# EAGLE design minimal_terminalv2_rc2014 (EAGLE 7.6.0)
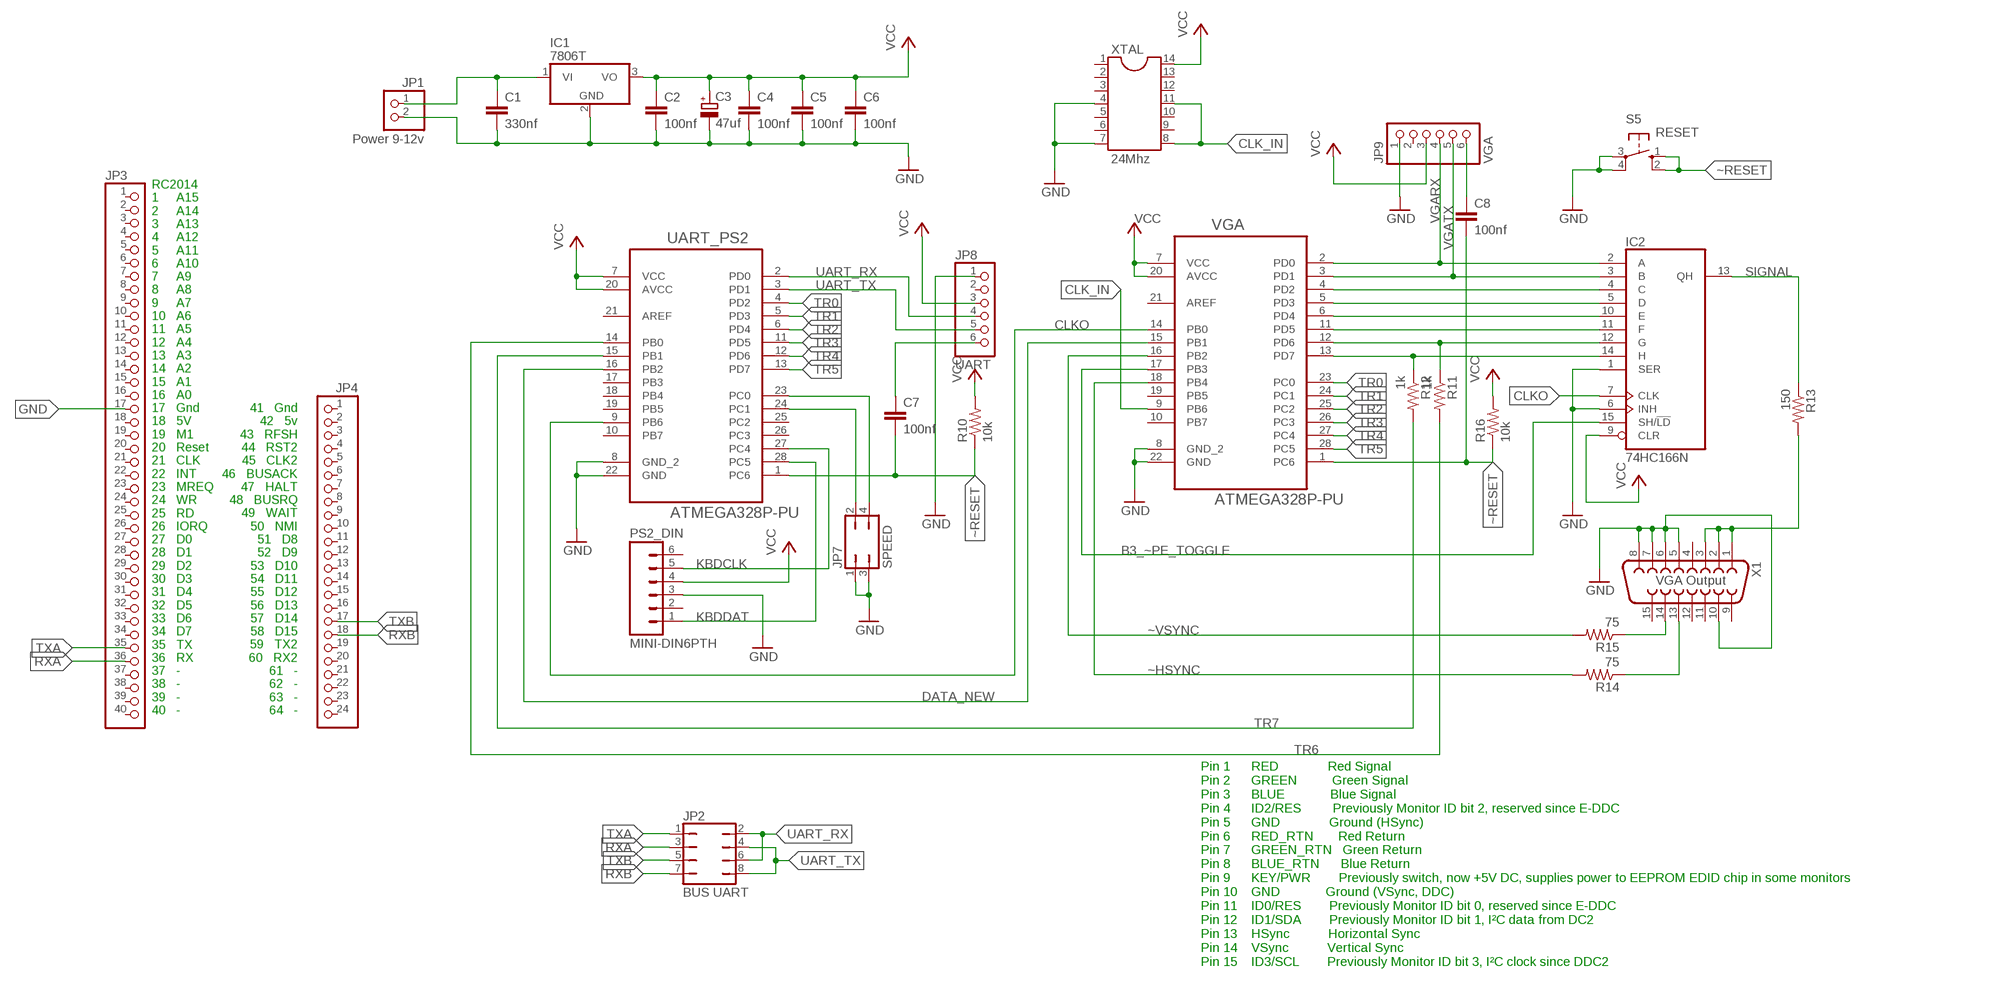
[diagram p0: schematic, sheet 1]

## Parts
C1  330nf  C2,5-3  [C2.5-3]
C2  100nf  C2,5-3  [C2.5-3]
C3  47uf  CPOL-EUE2.5-6  [E2,5-6]
C4  100nf  C2,5-3  [C2.5-3]
C5  100nf  C2,5-3  [C2.5-3]
C6  100nf  C2,5-3  [C2.5-3]
C7  100nf  C2,5-3  [C2.5-3]
C8  100nf  C2,5-3  [C2.5-3]
IC1  7806T  [TO220H]
IC2  74HC166N  [DIL16]
JP1  Power 9-12v  PINHD-1X2  [1X02]
JP2  BUS UART  JP4Q  [JP4Q]
JP3  PINHD-1X40  [1X40]
JP4  PINHD-1X24  [1X24]
JP7  SPEED  JP2Q  [JP2Q]
JP8  UART  PINHD-1X6  [1X06]
JP9  VGA  PINHD-1X6  [1X06]
PS2_DIN  MINI-DIN6PTH  [MINI-DIN6]
R10  10k  R-US_0204/7  [0204/7]
R11  1k  R-US_0204/7  [0204/7]
R12  1k  R-US_0204/7  [0204/7]
R13  150  R-US_0204/7  [0204/7]
R14  75  R-US_0204/7  [0204/7]
R15  75  R-US_0204/7  [0204/7]
R16  10k  R-US_0204/7  [0204/7]
S5  RESET  10-XX  [B3F-10XX]
UART_PS2  ATMEGA328P-PU  [DIP254P762X457-28]
VGA  ATMEGA328P-PU  [DIP254P762X457-28]
X1  VGA Output  F15HDH  [HDF15H]
XTAL  24Mhz  DIL14S  [SOCKET-14]

## Nets
B3_~PE_TOGGLE: IC2.15(SH/!LD) VGA.17(PB3)
CLK_IN: VGA.9(PB6) XTAL.8 XTAL.11
CLKO: IC2.7(CLK) UART_PS2.9(PB6) VGA.14(PB0)
DATA_NEW: UART_PS2.16(PB2) VGA.15(PB1)
GND [VCC]: C1.2 C2.2 C3.- C4.2 C5.2 C6.2 IC1.2(GND) IC2.1(SER) IC2.6(INH) JP1.2 JP3.17 JP7.1 JP7.3 JP8.1 JP9.1 PS2_DIN.3 S5.3(P) S5.4(P1) UART_PS2.8(GND_2) UART_PS2.22(GND) VGA.8(GND_2) VGA.22(GND) X1.5 X1.6 X1.7 X1.8 X1.10 XTAL.4 XTAL.7
KBDCLK: PS2_DIN.5 UART_PS2.27(PC4)
KBDDAT: PS2_DIN.1 UART_PS2.28(PC5)
N$9: C1.1 IC1.1(VI) JP1.1
N$14: C7.1 JP8.6
N$15: JP7.2 UART_PS2.24(PC1)
N$16: JP7.4 UART_PS2.23(PC0)
N$17: IC2.12(G) R11.1 VGA.12(PD6)
N$18: IC2.14(H) R12.1 VGA.13(PD7)
N$21: IC2.4(C) VGA.4(PD2)
N$22: IC2.5(D) VGA.5(PD3)
N$23: IC2.10(E) VGA.6(PD4)
N$24: IC2.11(F) VGA.11(PD5)
N$26: R13.2 X1.1 X1.2 X1.3
N$27: R14.1 X1.13
N$28: R15.1 X1.14
N$31: C8.1 JP9.6
RXA: JP2.3 JP3.36
RXB: JP2.7 JP4.18
SIGNAL: IC2.13(QH) R13.1
TR0: UART_PS2.4(PD2) VGA.23(PC0)
TR1: UART_PS2.5(PD3) VGA.24(PC1)
TR2: UART_PS2.6(PD4) VGA.25(PC2)
TR3: UART_PS2.11(PD5) VGA.26(PC3)
TR4: UART_PS2.12(PD6) VGA.27(PC4)
TR5: UART_PS2.13(PD7) VGA.28(PC5)
TR6: R11.2 UART_PS2.14(PB0)
TR7: R12.2 UART_PS2.15(PB1)
TXA: JP2.1 JP3.35
TXB: JP2.5 JP4.17
UART_RX: JP2.2 JP2.6 JP8.4 UART_PS2.2(PD0)
UART_TX: JP2.4 JP2.8 JP8.5 UART_PS2.3(PD1)
VCC [VCC]: C2.1 C3.+ C4.1 C5.1 C6.1 IC1.3(VO) IC2.9(CLR) JP8.3 JP9.3 PS2_DIN.4 R10.2 R16.2 UART_PS2.7(VCC) UART_PS2.20(AVCC) VGA.7(VCC) VGA.20(AVCC) XTAL.14
VGARX: IC2.2(A) JP9.4 VGA.2(PD0)
VGATX: IC2.3(B) JP9.5 VGA.3(PD1)
~HSYNC: R14.2 VGA.18(PB4)
~RESET: C7.2 C8.2 R10.1 R16.1 S5.1(S) S5.2(S1) UART_PS2.1(PC6) VGA.1(PC6)
~VSYNC: R15.2 VGA.16(PB2)
Unconnected: JP3.1 JP3.2 JP3.3 JP3.4 JP3.5 JP3.6 JP3.7 JP3.8 JP3.9 JP3.10 JP3.11 JP3.12 JP3.13 JP3.14 JP3.15 JP3.16 JP3.18 JP3.19 JP3.20 JP3.21 JP3.22 JP3.23 JP3.24 JP3.25 JP3.26 JP3.27 JP3.28 JP3.29 JP3.30 JP3.31 JP3.32 JP3.33 JP3.34 JP3.37 JP3.38 JP3.39 JP3.40 JP4.1 JP4.2 JP4.3 JP4.4 JP4.5 JP4.6 JP4.7 JP4.8 JP4.9 JP4.10 JP4.11 JP4.12 JP4.13 JP4.14 JP4.15 JP4.16 JP4.19 JP4.20 JP4.21 JP4.22 JP4.23 JP4.24 JP8.2 JP9.2 PS2_DIN.2 PS2_DIN.6 UART_PS2.10(PB7) UART_PS2.17(PB3) UART_PS2.18(PB4) UART_PS2.19(PB5) UART_PS2.21(AREF) UART_PS2.25(PC2) UART_PS2.26(PC3) VGA.10(PB7) VGA.19(PB5) VGA.21(AREF) X1.4 X1.9 X1.11 X1.12 X1.15 XTAL.1 XTAL.2 XTAL.3 XTAL.5 XTAL.6 XTAL.9 XTAL.10 XTAL.12 XTAL.13

## Notes on the sheet
- RC2014
  1     A15
  2     A14
  3     A13
  4     A12
  5     A11
  6     A10
  7     A9
  8     A8
  9     A7
  10   A6
  11   A5
  12   A4
  13   A3
  14   A2
  15   A1
  16   A0
  17   Gnd
  18   5V
  19   M1
  20   Reset
  21   CLK
  22   INT
  23   MREQ
  24   WR
  25   RD
  26   IORQ
  27   D0
  28   D1
  29   D2
  30   D3
  31   D4
  32   D5
  33   D6
  34   D7
  35   TX
  36   RX
  37   -
  38   -
  39   -
  40   -
- 41   Gnd
  42   5v
  43   RFSH
  44   RST2
  45   CLK2
  46   BUSACK
  47   HALT
  48   BUSRQ
  49   WAIT
  50   NMI
  51   D8
  52   D9
  53   D10
  54   D11
  55   D12
  56   D13
  57   D14
  58   D15
  59   TX2
  60   RX2
  61   -
  62   -
  63   -
  64   -
- Pin 1      RED              Red Signal
  Pin 2      GREEN          Green Signal
  Pin 3      BLUE             Blue Signal
  Pin 4      ID2/RES         Previously Monitor ID bit 2, reserved since E-DDC
  Pin 5      GND              Ground (HSync)
  Pin 6      RED_RTN       Red Return
  Pin 7      GREEN_RTN   Green Return
  Pin 8      BLUE_RTN      Blue Return
  Pin 9      KEY/PWR        Previously switch, now +5V DC, supplies power to EEPROM EDID chip in some monitors
  Pin 10    GND             Ground (VSync, DDC)
  Pin 11    ID0/RES        Previously Monitor ID bit 0, reserved since E-DDC
  Pin 12    ID1/SDA        Previously Monitor ID bit 1, I²C data from DC2
  Pin 13    HSync           Horizontal Sync
  Pin 14    VSync           Vertical Sync
  Pin 15    ID3/SCL        Previously Monitor ID bit 3, I²C clock since DDC2

## Power pins joined to a net without a drawn wire
GND: IC2.8(GND)
VCC: IC2.16(VCC)

## Library data of the parts
C1 C2 C4-C8 = capacitor-wima:C: CAPACITOR naming: grid - package width
C3 = rcl:CPOL-EU: POLARIZED CAPACITOR, European symbol
IC1 = linear:78*: Positive VOLTAGE REGULATOR Source: http://cache.national.com/ds/LM/LM78L05.pdf http://www.fairchildsemi.com/ds/LM/LM7805.pdf
IC2 = 74xx-eu:74*166: 8-bit parallel load SHIFT REGISTER
JP1 = pinhead:PINHD-1X2: PIN HEADER
JP2 = jumper:JP4Q: JUMPER
JP3 = pinhead:PINHD-1X40: PIN HEADER
JP4 = pinhead:PINHD-1X24: PIN HEADER
JP7 = jumper:JP2Q: JUMPER
JP8 JP9 = adafruit:PINHD-1X6: PIN HEADER
PS2_DIN = SparkFun-Connectors:MINI-DIN6: mini DIN 6 Connector Commonly found on the back of a computer for PS2 keyboard and mice. Schematic and footprint are proven. Spark Fun Electronics SKU : PRT-08509
R10-R16 = adafruit:R-US_: RESISTOR, American symbol
S5 = switch-omron:10-XX: OMRON SWITCH; MPN: B3F-1000; OC_FARNELL: 176432; OC_NEWARK: 36M3542
UART_PS2 VGA = Atmel_By_element14_Batch_1-00:ATMEGA328P-PU: 8-bit Microcontroller with In-System Programmable Flash; MPN: ATMEGA328P-PU; OC_FARNELL: 1715487; OC_NEWARK: 15R0268; PACKAGE: PDIP-28; SUPPLIER: Atmel
X1 = adafruit:F15: SUB-D HDH is also known as a 'right angle VGA' connector
XTAL = ic-package:DIL14: Dual In Line / Socket

## Net classes
1 VCC: width 0.61 mm

## Board
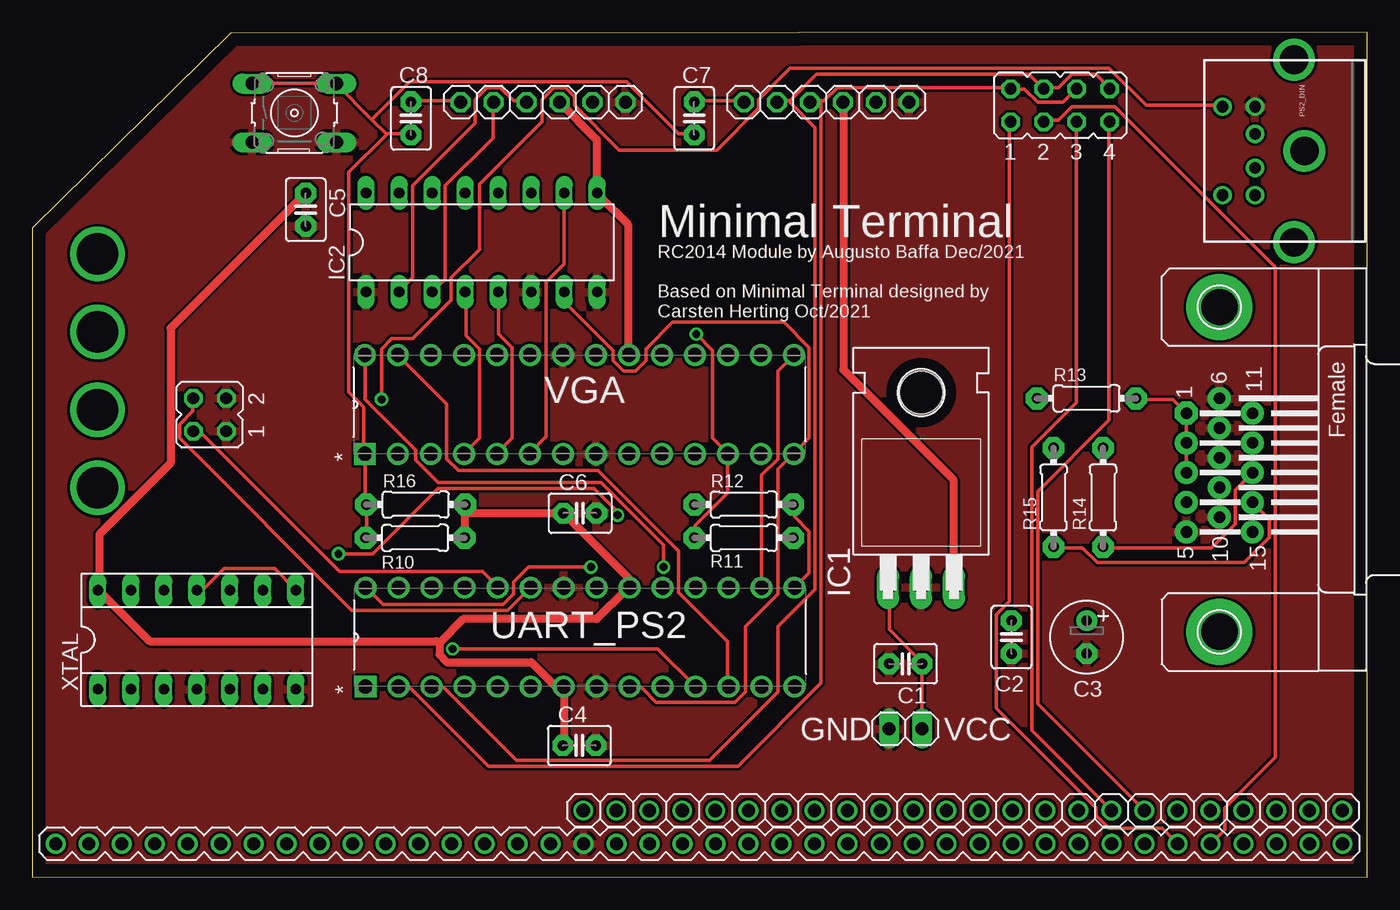
[diagram p1: board, top side]
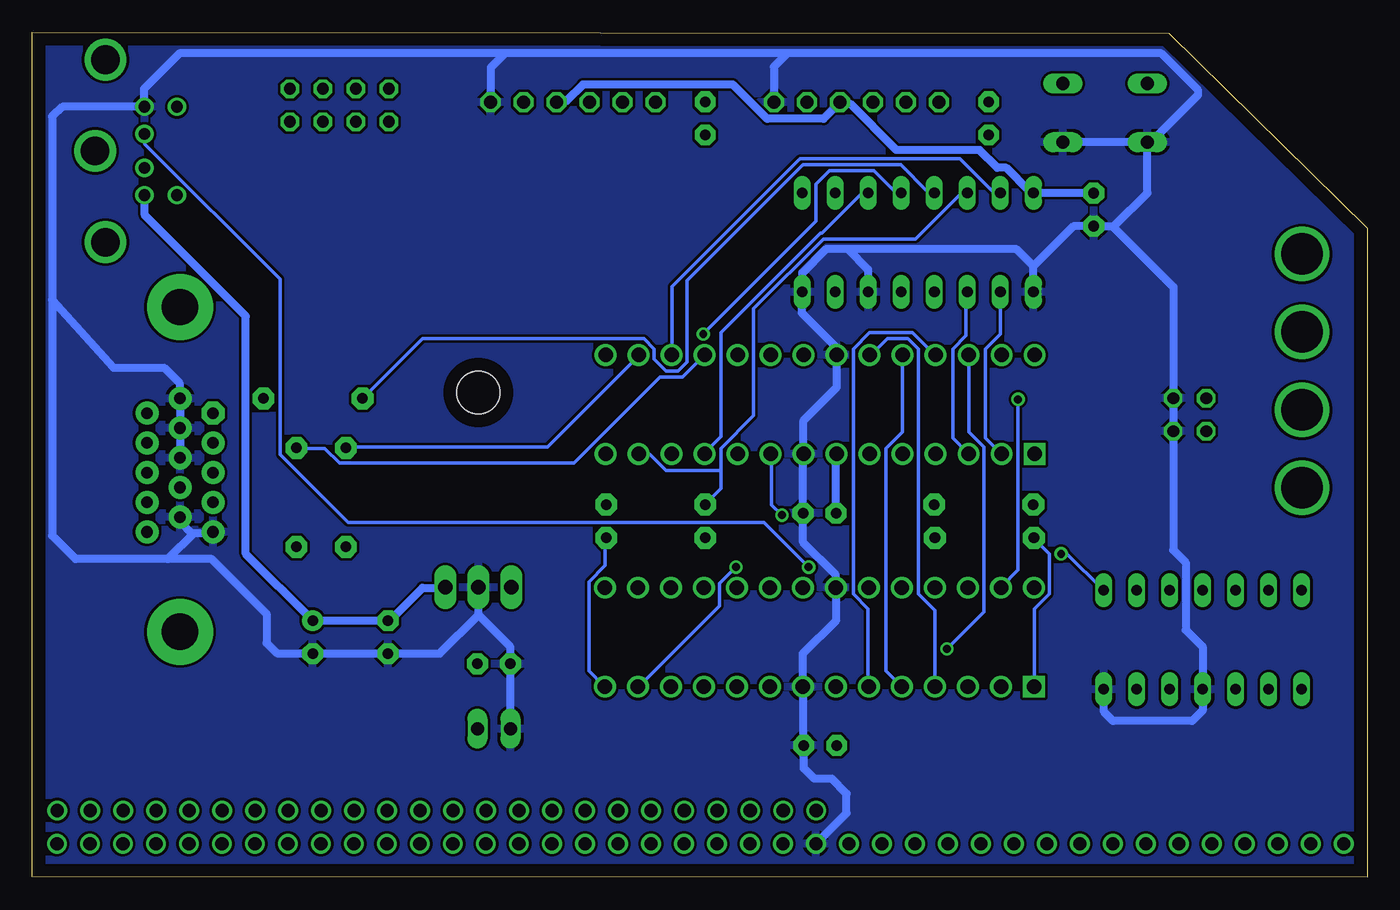
[diagram p2: board, bottom side, seen from below]

Size 102.72 x 65.05 mm. Coordinates in mm from the lower left corner, seen from the top.
Outline: 0,0 102.72,0.05 102.72,65.05 15.24,65 0,50 0,0
Copper layers (1*16): Top 0.035mm / dielectric 1.5mm / Bottom 0.035mm
Design rules "default": minimum track width 10mil, minimum drill 24mil, track to track 8mil, track to pad 8mil, pad to pad 8mil, via to via 8mil, smd to smd 8mil, copper to edge 40mil, drill to drill 8mil, minimum pad ring 10mil, minimum via ring 8mil, stop-mask expansion 4mil, vias tented up to drill 0mil, thermal gap 10mil

### Footprints (pad centres in the part's own frame; a part is rotated, then mirrored left to right if it is on the bottom)
C2.5-3 = drill 0.813 pad 1.6 octagon: 1 -1.27,0; 2 1.27,0
E2,5-6 = drill 0.813 pad 1.6: + -1.27,0 | drill 0.813 pad 1.6 octagon: - 1.27,0
TO220H = drill 1.118 long: 1 -2.54,-10.16; 2 0,-10.16; 3 2.54,-10.16 | hole 3.302: 0,4.826
DIL16 = drill 0.813 long: 1 -8.89,-3.81; 2 -6.35,-3.81; 3 -3.81,-3.81; 4 -1.27,-3.81; 5 1.27,-3.81; 6 3.81,-3.81; 7 6.35,-3.81; 8 8.89,-3.81; 9 8.89,3.81; 10 6.35,3.81; 11 3.81,3.81; 12 1.27,3.81; 13 -1.27,3.81; 14 -3.81,3.81; 15 -6.35,3.81; 16 -8.89,3.81
1X02 = drill 1.016 long: 1 -1.27,0; 2 1.27,0
JP4Q = drill 0.914 octagon: 1 -3.81,-1.27; 2 -3.81,1.27; 3 -1.27,-1.27; 4 -1.27,1.27; 5 1.27,-1.27; 6 1.27,1.27; 7 3.81,-1.27; 8 3.81,1.27
1X40 = drill 1.016: 1 -49.53,0; 2 -46.99,0; 3 -44.45,0; 4 -41.91,0; 5 -39.37,0; 6 -36.83,0; 7 -34.29,0; 8 -31.75,0; 9 -29.21,0; 10 -26.67,0; 11 -24.13,0; 12 -21.59,0; 13 -19.05,0; 14 -16.51,0; 15 -13.97,0; 16 -11.43,0; 17 -8.89,0; 18 -6.35,0; 19 -3.81,0; 20 -1.27,0; 21 1.27,0; 22 3.81,0; 23 6.35,0; 24 8.89,0; 25 11.43,0; 26 13.97,0; 27 16.51,0; 28 19.05,0; 29 21.59,0; 30 24.13,0; 31 26.67,0; 32 29.21,0; 33 31.75,0; 34 34.29,0; 35 36.83,0; 36 39.37,0; 37 41.91,0; 38 44.45,0; 39 46.99,0; 40 49.53,0
1X24 = drill 1.016: 1 -29.21,0; 2 -26.67,0; 3 -24.13,0; 4 -21.59,0; 5 -19.05,0; 6 -16.51,0; 7 -13.97,0; 8 -11.43,0; 9 -8.89,0; 10 -6.35,0; 11 -3.81,0; 12 -1.27,0; 13 1.27,0; 14 3.81,0; 15 6.35,0; 16 8.89,0; 17 11.43,0; 18 13.97,0; 19 16.51,0; 20 19.05,0; 21 21.59,0; 22 24.13,0; 23 26.67,0; 24 29.21,0
JP2Q = drill 0.914 octagon: 1 -1.27,-1.27; 2 -1.27,1.27; 3 1.27,-1.27; 4 1.27,1.27
1X06 = drill 1.016 octagon: 1 -6.35,0; 2 -3.81,0; 3 -1.27,0; 4 1.27,0; 5 3.81,0; 6 6.35,0
MINI-DIN6 = drill 0.9: 1 -1.3,-8.5; 2 1.3,-8.5; 3 -3.4,-8.5; 4 3.4,-8.5; 5 -3.4,-11; 6 3.4,-11 | drill 2.2: P$1 0,-4.7
0204/7 = drill 0.813 pad 1.676 octagon: 1 -3.81,0; 2 3.81,0
B3F-10XX = drill 1.016 long: 1 -3.251,2.261; 2 3.251,2.261; 3 -3.251,-2.261; 4 3.251,-2.261
DIP254P762X457-28 = drill 1.118 square: 1 -7.62,33.02 | drill 1.118: 2 -7.62,30.48; 3 -7.62,27.94; 4 -7.62,25.4; 5 -7.62,22.86; 6 -7.62,20.32; 7 -7.62,17.78; 8 -7.62,15.24; 9 -7.62,12.7; 10 -7.62,10.16; 11 -7.62,7.62; 12 -7.62,5.08; 13 -7.62,2.54; 14 -7.62,0; 15 0,0; 16 0,2.54; 17 0,5.08; 18 0,7.62; 19 0,10.16; 20 0,12.7; 21 0,15.24; 22 0,17.78; 23 0,20.32; 24 0,22.86; 25 0,25.4; 26 0,27.94; 27 0,30.48; 28 0,33.02
HDF15H = drill 0.9 pad 1.778 octagon: 1 4.329,2.54 | drill 0.9 pad 1.778: 2 2.043,2.54; 3 -0.243,2.54; 4 -2.529,2.54; 5 -4.815,2.54; 6 5.472,0; 7 3.186,0; 8 0.9,0; 9 -1.386,0; 10 -3.672,0; 11 4.329,-2.54; 12 2.043,-2.54; 13 -0.243,-2.54; 14 -2.529,-2.54; 15 -4.815,-2.54 | drill 2.8 pad 5.08: P$1 -12.5,0; P$2 12.5,0
SOCKET-14 = drill 0.813 long: 1 -7.62,-3.81; 2 -5.08,-3.81; 3 -2.54,-3.81; 4 0,-3.81; 5 2.54,-3.81; 6 5.08,-3.81; 7 7.62,-3.81; 8 7.62,3.81; 9 5.08,3.81; 10 2.54,3.81; 11 0,3.81; 12 -2.54,3.81; 13 -5.08,3.81; 14 -7.62,3.81

### Placement (x,y rotation side)
C1  67.2,16.45 180 top
C2  75.35,18.5 270 top
C3  81.15,18.5 270 top
C4  42.09,10.16 0 top
C5  21.03,51.41 270 top
C6  42.14,28.04 0 top
C7  50.93,58.44 270 top
C8  29.13,58.44 270 top
IC1  68.4,32.5 0 top
IC2  34.57,48.89 0 top
JP1  67.2,11.45 180 top
JP2  79.1,59.45 0 top
JP3  51.31,2.6 0 top
JP4  71.61,5.15 0 top
JP7  13.64,35.62 90 top
JP8  61.11,59.69 180 top
JP9  39.3,59.69 180 top
PS2_DIN  102.6,55.93 270 top
R10  29.45,26.14 0 top
R11  54.75,26.14 0 top
R12  54.75,28.71 0 top
R13  81.13,36.88 0 top
R14  82.4,29.26 90 top
R15  78.59,29.26 90 top
R16  29.5,28.71 0 top
S5  20.16,58.86 0 top
UART_PS2  58.66,22.31 90 top
VGA  58.61,40.22 90 top
X1  91.36,31.41 90 top
XTAL  12.65,18.3 0 top

### Tracks (layer width: path | path; a pad name or v marks a point on that pad's centre or on a via)
B3_~PE_TOGGLE
  Bottom 0.254: IC2.15 28.23,52.81 28.8,52.81 31.32,55.32 43.66,55.32 53.49,45.49 53.49,40.23 VGA.17
CLK_IN  (via drill 0.61)
  Top 0.254: XTAL.11 12.69,22.17 13.14,22.17 14.74,23.77 18.63,23.77 20.23,22.17 XTAL.8 | v45.03,27.89 45.03,28.12 43.2,29.95 31.2,29.95 26.18,24.92 v23.55,24.92
  Bottom 0.254: v45.03,27.89 45.83,28.69 45.83,32.58 VGA.9 | v23.55,24.92 23.09,24.92 20.34,22.17 XTAL.8
CLKO
  Top 0.254: IC2.7 41.03,45.03 41.03,44.23 44.69,40.58 44.69,39.78 45.49,38.98 46.41,38.98 47.21,39.78 47.21,40.69 49.26,42.75 57.84,42.75 59.78,40.8 59.78,33.83 58.64,32.69 VGA.14 58.52,32.58 57.38,31.43 57.38,21.83 54.86,19.32 54.86,14.29 54.06,13.49 48.01,13.49 46.86,14.63 46.06,14.63 UART_PS2.9
DATA_NEW
  Top 0.254: UART_PS2.16 56.12,22.4 56.12,30.98 57.38,32.23 57.38,38.98 58.52,40.12 VGA.15
GND
  Bottom 0.61: 40,48.4 41.6,48.4 43.46,46.54 IC2.8 43.5,45.04 43.5,43.45 40.83,40.78 VGA.22 40.8,40.19 40.8,37.75 43.37,35.18 VGA.8 43.41,32.56 C6.2 43.4,25.8 40.88,23.28 UART_PS2.22 40.85,22.28 40.85,19.8 43.42,17.23 UART_PS2.8 43.36,14.63 C4.2 43.35,8.4 42.55,7.6 41.2,7.6 40.05,6.45 40.05,4.95 42.4,2.6 JP3.17 | 40,48.4 38.4,46.8 38.4,45.1 IC2.6 | IC2.1 25.68,47.05 | 40,48.4 27.03,48.4 25.68,47.05 | 25.68,47.05 22.59,50.14 C5.2 19.59,50.14 19.4,49.95 | 19.4,49.95 14.9,45.45 JP7.3 JP7.1 14.91,25.21 13.95,24.25 13.95,19.05 12.65,17.75 XTAL.4 12.65,12.85 13.45,12.05 19.55,12.05 20.25,12.75 20.25,14.47 XTAL.7 | 19.4,49.95 19.4,50.2 16.9,52.7 S5.3 | S5.3 S5.4 | S5.3 16.65,56.6 13,60.25 13,60.6 15.85,63.45 44.6,63.45 | 44.6,63.45 45.65,62.4 JP9.1 | 44.6,63.45 66.35,63.45 | 66.35,63.45 67.45,62.35 JP8.1 | 66.35,63.45 91.4,63.45 94.15,60.7 94.15,59.38 PS2_DIN.3 100.42,59.33 101.2,58.6 101.2,44.45 | 101.2,44.45 96.5,39.25 92.6,39.25 91.4,38.05 91.4,36.92 X1.6 X1.7 X1.8 | X1.10 91.36,27.41 90.45,26.5 90.31,26.5 | X1.5 88.92,26.5 90.31,26.5 | 68.4,20.2 71.37,17.23 C2.2 C3.- 81.17,17.25 83.9,17.25 84.7,18.05 84.7,20.3 88.92,24.52 92.3,24.52 | 68.4,20.2 IC1.2 | JP1.2 C1.2 65.93,17.73 68.4,20.2 | 92.3,24.52 99.4,24.52 101.2,26.32 101.2,44.45 | 90.31,26.5 92.3,24.52
  pour Top: 0,0 0,50 15.24,65 102.72,65.05 102.72,0.05
  pour Bottom: 0,0 0,50 15.24,65 102.72,65.05 102.72,0.05
KBDCLK  (via drill 0.61)
  Top 0.254: v26.86,36.8 26.86,40.69 27.66,41.49 29.26,41.49 32.23,44.46 32.23,46.18 34.4,48.35 34.4,53.38 39.2,58.18 39.2,59.89 40.12,60.81 41.03,60.81 41.72,60.12 41.72,59.44 45.15,56.01 52.69,56.01 55.89,59.21 55.89,59.89 58.29,62.29 82.87,62.29 85.72,59.44 91.55,59.44 PS2_DIN.5
  Bottom 0.254: v26.86,36.8 26.86,23.66 28.12,22.4 UART_PS2.27
KBDDAT  (via drill 0.61)
  Top 0.254: v42.98,23.89 38.18,23.89 37.03,22.75 37.03,21.83 36.23,21.03 26.98,21.03 25.72,22.29 UART_PS2.28
  Bottom 0.254: v42.98,23.89 46.41,27.32 78.41,27.32 83.67,32.58 83.67,46.06 94.07,56.46 94.07,57.15 PS2_DIN.1
N$1  (via drill 3.2)
  other vias: 5,42
N$2  (via drill 3.2)
  other vias: 5,30
N$3  (via drill 2.2)
  other vias: 97.1,48.9
N$4  (via drill 2.2)
  other vias: 97.1,62.95
N$9
  Top 0.254: JP1.1 68.47,11.54 68.47,16.34 C1.1 68.47,16.57 65.95,19.09 65.95,22.29 IC1.1
N$14
  Top 0.254: JP8.6 54.75,59.78 50.98,59.78 C7.1
N$15
  Top 0.254: JP7.2 12.46,34.29 12.92,34.29 23.66,23.55 34.63,23.55 35.78,22.4 UART_PS2.24
N$16
  Top 0.254: JP7.4 12.34,36.8 12.34,35.89 11.32,34.86 11.32,33.83 24.57,20.57 36.58,20.57 38.29,22.29 UART_PS2.23
N$17  (via drill 0.61)
  Top 0.254: v51.09,41.83 52.35,40.58 52.35,33.83 53.49,32.69 VGA.12 53.49,32.58 53.49,29.6 50.98,27.09 50.98,26.18 R11.1
  Bottom 0.254: v51.09,41.83 42.41,50.52 42.41,53.38 41.38,54.41 37.95,54.41 36.35,52.81 35.89,52.81 IC2.12
N$18
  Bottom 0.254: 49.72,31.32 49.72,29.95 50.86,28.8 R12.1 | 49.72,31.32 49.72,33.03 47.21,35.55 47.21,43.78 41.83,49.15 34.75,49.15 31.2,52.69 30.86,52.69 IC2.14 | 49.72,31.32 53.95,31.32 55.21,32.58 56.01,32.58 VGA.13
N$20  (via drill 3.2)
  other vias: 5,48
N$21
  Top 0.254: IC2.4 33.38,45.03 33.38,41.72 34.4,40.69 34.4,33.83 33.26,32.69 VGA.4
N$22
  Top 0.254: IC2.5 35.89,45.03 35.89,41.83 36.92,40.8 36.92,33.83 35.78,32.69 VGA.5
N$23
  Top 0.254: IC2.10 40.92,47.21 39.55,45.83 39.55,33.95 38.29,32.69 VGA.6
N$24
  Bottom 0.254: IC2.11 38.41,52.69 38.86,52.69 41.95,49.61 42.06,49.61 49.72,41.95 49.72,33.95 50.98,32.69 VGA.11
N$25  (via drill 3.2)
  other vias: 5,36
N$26
  Top 0.254: X1.3 88.81,31.2 88.81,33.38 X1.2 88.81,33.49 88.81,35.66 X1.1 88.81,35.78 87.78,36.8 85.04,36.8 R13.2
N$27
  Top 0.254: R14.1 82.41,25.38 90.75,25.38 92.58,27.2 92.58,29.83 93.84,31.09 X1.13
N$28
  Top 0.254: R15.1 78.64,25.38 80.81,25.38 81.95,24.23 93.27,24.23 95.21,26.18 95.21,27.55 93.95,28.8 X1.14
N$31
  Top 0.254: JP9.6 32.92,59.78 29.15,59.78 C8.1
RXA
  Top 0.254: JP2.3 77.84,58.29 78.98,58.29 80.01,59.32 83.33,59.32 95.67,46.98 95.67,9.26 91.78,5.37 91.78,3.66 90.75,2.63 JP3.36
RXB
  Top 0.254: JP2.7 82.87,58.18 82.87,35.2 77.38,29.72 77.38,13.37 85.5,5.26 JP4.18
SIGNAL
  Bottom 0.254: IC2.13 33.38,52.81 33.83,52.81 35.89,54.86 43.43,54.86 52.35,45.95 52.35,39.66 53.03,38.98 53.95,38.98 54.86,39.89 54.86,40.69 55.66,41.49 72.69,41.49 77.27,36.92 R13.1
TR0
  Bottom 0.254: UART_PS2.4 33.26,14.74 33.26,20.57 34.52,21.83 34.52,40.69 35.32,41.49 36.92,41.49 38.18,40.23 VGA.23
TR1
  Bottom 0.254: VGA.24 35.78,40.12 35.78,34.29 37.03,33.03 37.03,15.89 35.89,14.74 UART_PS2.5
TR2
  Bottom 0.254: UART_PS2.6 38.41,14.74 38.41,20.69 39.55,21.83 39.55,40.69 38.29,41.95 34.98,41.95 33.26,40.23 VGA.25
TR3  (via drill 0.61)
  Top 0.254: v32.35,17.6 48.12,17.6 50.98,14.74 UART_PS2.11
  Bottom 0.254: v32.35,17.6 29.49,20.46 29.49,33.15 30.63,34.29 30.63,40.12 VGA.26
TR4
  Top 0.254: UART_PS2.12 53.49,14.74 53.49,18.17 49.72,21.95 49.72,25.15 43.55,31.32 32.8,31.32 31.89,32.23 31.89,36.46 28.23,40.12 VGA.27
TR5  (via drill 0.61)
  Top 0.254: v48.58,23.89 48.58,25.6 43.78,30.4 31.2,30.4 29.49,32.12 29.49,32.92 25.6,36.8 25.6,40.12 VGA.28
  Bottom 0.254: v48.58,23.89 49.84,22.63 49.84,20.92 56.01,14.74 UART_PS2.13
TR6
  Bottom 0.254: R11.2 58.64,26.06 58.64,24 59.89,22.75 59.89,15.89 58.75,14.74 UART_PS2.14
TR7
  Top 0.254: R12.2 58.64,28.69 58.64,27.77 59.78,26.63 59.78,23.43 58.75,22.4 UART_PS2.15
TXA
  Top 0.254: JP2.1 75.21,58.18 75.21,21.26 74.18,20.23 74.18,13.03 81.84,5.37 81.84,4.8 82.87,3.77 86.98,3.77 88.12,2.63 JP3.35
TXB
  Top 0.254: JP2.5 80.35,58.18 80.35,36.58 76.92,33.15 76.92,11.32 82.98,5.26 JP4.17
UART_RX
  Top 0.254: JP2.6 80.35,60.69 79.32,59.66 77.38,59.66 76.35,60.69 75.32,60.69 JP2.2 75.21,60.81 61.95,60.81 60.92,59.78 60.69,59.78 | 60.69,59.78 59.89,59.78 JP8.4 | 60.69,59.78 60.69,14.97 54.29,8.57 35.09,8.57 29.03,14.63 28.23,14.63 UART_PS2.2
UART_TX
  Top 0.254: JP2.8 82.87,60.81 81.84,61.84 80.01,61.84 78.98,60.81 77.84,60.81 JP2.4 77.72,60.81 76.69,61.84 60.35,61.84 58.29,59.78 | 58.29,59.78 57.38,59.78 JP8.5 | UART_PS2.3 30.75,14.63 31.66,14.63 37.26,9.03 52.12,9.03 57.38,14.29 57.38,19.32 60.24,22.17 60.24,57.72 58.29,59.66 58.29,59.78
VCC
  Top 0.61: JP9.3 40.58,59.66 43.43,56.81 43.43,52.81 IC2.9 43.66,52.46 45.83,50.29 45.83,40.23 VGA.20 | C4.1 40.92,10.17 40.92,14.63 UART_PS2.7 40.58,14.63 40.35,14.63 38.41,16.57 31.89,16.57 31.32,17.14 31.32,18.06 | R10.2 33.26,26.18 33.26,28.69 R16.2 33.49,28 40.58,28 C6.1 40.92,28 45.95,22.97 45.95,22.4 UART_PS2.20 45.72,22.17 43.43,19.89 33.15,19.89 31.32,18.06 | C5.1 20.92,52.58 10.63,42.29 10.63,31.89 5.14,26.4 5.14,22.17 XTAL.14 5.26,21.95 9.03,18.17 31.09,18.17 31.32,18.06 | IC1.3 70.87,22.4 70.87,30.63 62.41,39.09 62.41,59.66 JP8.3
  Bottom 0.61: PS2_DIN.4 94.07,52.46 94.07,50.98 86.3,43.2 86.3,24.92 C3.+ 80.92,19.77 75.44,19.77 C2.1 75.09,19.89 72.69,22.29 70.98,22.29 IC1.3 | JP8.3 62.29,59.78 61.61,59.78 60.35,61.04 48.81,61.04 46.18,58.41 41.83,58.41 40.58,59.66 JP9.3 40.35,59.55 39.78,59.55 36.23,56.01 29.83,56.01 28.46,54.63 27.77,54.63 25.95,52.81 IC2.16 25.6,52.69 21.03,52.69 C5.1 | C6.1 40.92,28.12 40.92,32.58 VGA.7
VGARX
  Top 0.254: JP9.4 37.95,59.78 37.03,59.78 36.01,60.81 34.98,60.81 34.06,59.89 34.06,58.06 29.26,53.26 29.26,46.18 28.23,45.15 IC2.2
  Bottom 0.254: IC2.2 28.23,45.03 28.23,41.83 29.38,40.69 29.38,33.83 28.23,32.69 VGA.2
VGATX
  Top 0.254: JP9.5 35.43,59.66 35.43,56.92 31.77,53.26 31.77,46.06 30.86,45.15 IC2.3
  Bottom 0.254: IC2.3 30.86,45.03 30.86,41.72 31.89,40.69 31.89,33.83 30.75,32.69 VGA.3
~HSYNC
  Bottom 0.254: R14.2 82.3,33.03 80.24,33.03 79.1,31.89 61.04,31.89 54.41,38.52 52.69,38.52 51.09,40.12 VGA.18
~RESET
  Top 0.254: R10.1 25.72,26.18 25.72,28.69 R16.1 25.6,28.8 25.6,32.58 VGA.1 25.49,32.69 25.49,36.23 24.35,37.38 24.35,54.29 27.2,57.15 27.2,57.26 | S5.1 16.92,61.15 23.32,61.15 S5.2 23.43,61.04 26.12,58.35 | 27.2,57.26 29.03,57.26 C8.2 | 26.12,58.35 27.2,57.26 | 26.12,58.35 29.03,61.27 45.72,61.27 49.72,57.26 50.86,57.26 C7.2
  Bottom 0.254: UART_PS2.1 25.6,14.74 25.6,20.69 24.46,21.83 24.46,24.92 25.6,26.06 R10.1
~VSYNC
  Bottom 0.254: R15.2 78.52,33.15 63.09,33.15 56.12,40.12 VGA.16

### Text on the board
tNames: Minimal Terminal | RC2014 Module by Augusto Baffa Dec/2021 / / Based on Minimal Terminal designed by / Carsten Herting Oct/2021 | GND VCC
tValues: rst tx rx vcc - gnd | rst tx rx vcc - gnd | tx1 rx1 tx2 rx2 | PS/2 Input